# EAGLE design hbridge (EAGLE 7.5.0)
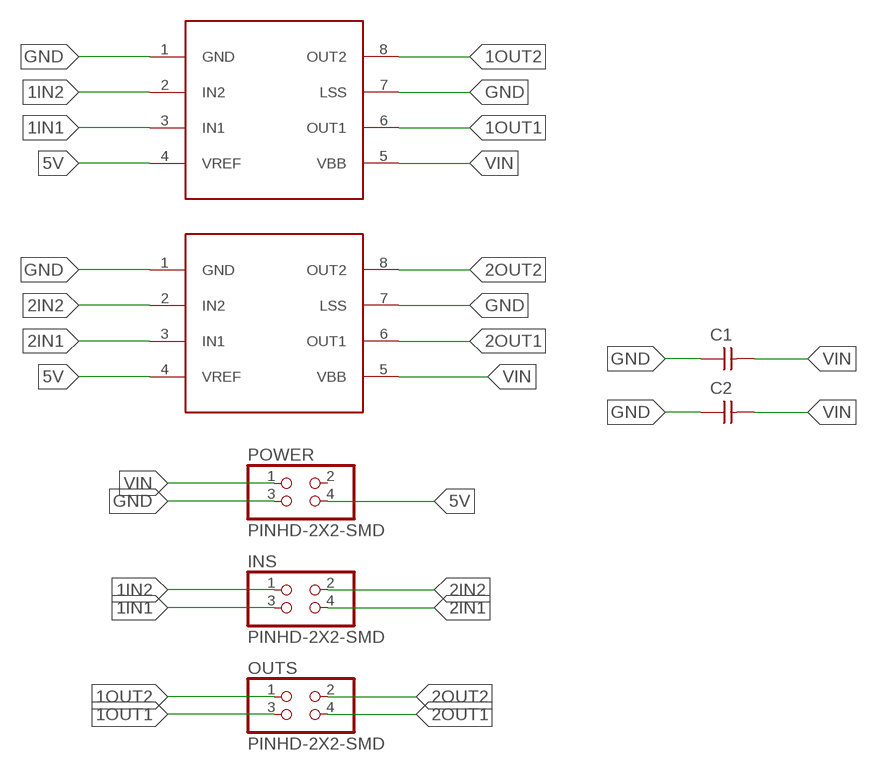
[diagram p0: schematic, sheet 1]

## Parts
C1  CAP-UNPOLARIZEDFAB  [C1206FAB]
C2  CAP-UNPOLARIZEDFAB  [C1206FAB]
INS  PINHD-2X2-SMD  [2X02SMD]
OUTS  PINHD-2X2-SMD  [2X02SMD]
POWER  PINHD-2X2-SMD  [2X02SMD]
U$1  A4953-H-BRIDGE-MOTOR-DRIVER  [SOIC8]
U$2  A4953-H-BRIDGE-MOTOR-DRIVER  [SOIC8]

## Nets
1IN1: INS.3 U$1.3(IN1)
1IN2: INS.1 U$1.2(IN2)
1OUT1: OUTS.3 U$1.6(OUT1)
1OUT2: OUTS.1 U$1.8(OUT2)
2IN1: INS.4 U$2.3(IN1)
2IN2: INS.2 U$2.2(IN2)
2OUT1: OUTS.4 U$2.6(OUT1)
2OUT2: OUTS.2 U$2.8(OUT2)
5V: POWER.4 U$1.4(VREF) U$2.4(VREF)
GND: C1.1 C2.1 POWER.3 U$1.1(GND) U$1.7(LSS) U$2.1(GND) U$2.7(LSS)
VIN: C1.2 C2.2 POWER.1 U$1.5(VBB) U$2.5(VBB)
Unconnected: POWER.2

## Library data of the parts
C1 C2 = fab:CAP-UNPOLARIZED
INS OUTS POWER = fab:PINHD-2X2-SMD
U$1 U$2 = fab:A4953-H-BRIDGE-MOTOR-DRIVER

## Board
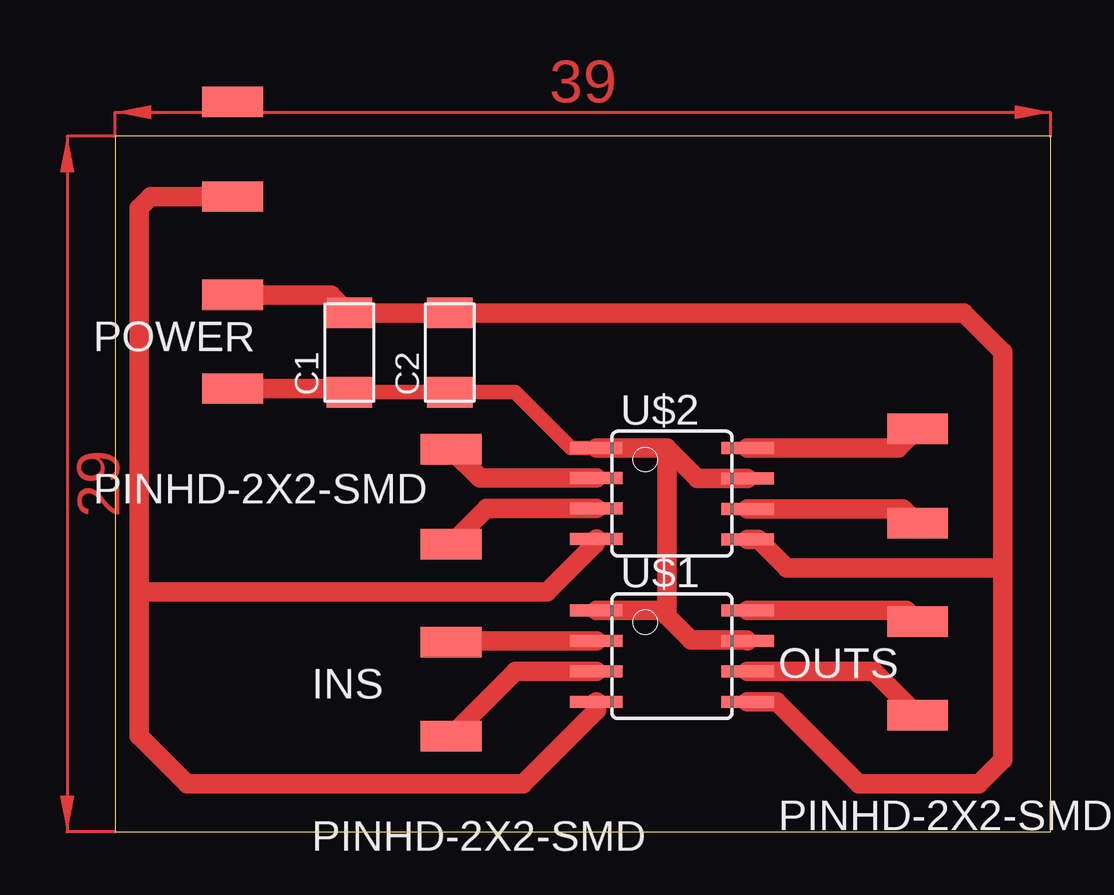
[diagram p1: board, top side]

Size 39 x 29 mm. Coordinates in mm from the lower left corner, seen from the top.
Outline: 0,0 39,0 39,29 0,29 0,0
Copper layers (1*16): Top 0.035mm / dielectric 1.5mm / Bottom 0.035mm
Design rules "default": minimum track width 10mil, minimum drill 24mil, track to track 8mil, track to pad 8mil, pad to pad 8mil, via to via 8mil, smd to smd 8mil, copper to edge 40mil, drill to drill 8mil, minimum pad ring 10mil, minimum via ring 8mil, stop-mask expansion 4mil, vias tented up to drill 0mil, thermal gap 10mil

### Footprints (pad centres in the part's own frame; a part is rotated, then mirrored left to right if it is on the bottom)
C1206FAB = smd 1.27 x 1.905: 1 -1.651,0; 2 1.651,0
2X02SMD = smd 2.54 x 1.27: 1 2,4.905; 2 2,12.945; 3 2,1; 4 2,9
SOIC8 = smd 0.5 x 2.2: 1 -1.905,-3.154; 2 -0.645,-3.154; 3 0.625,-3.154; 4 1.895,-3.154; 5 1.905,3.154; 6 0.635,3.154; 7 -0.635,3.154; 8 -1.905,3.154

### Placement (x,y rotation side)
C1  9.76,19.98 90 top
C2  13.95,19.98 90 top
INS  12,3 0 top
OUTS  31.45,3.86 0 top
POWER  2.89,17.48 0 top
U$1  23.21,7.32 270 top
U$2  23.21,14.1 270 top

### Tracks (layer width: path | path; a pad name or v marks a point on that pad's centre or on a via)
1IN1
  Top 0.813: U$1.3 16.7,6.7 INS.3
1IN2
  Top 0.813: U$1.2 14.06,7.96 INS.1
1OUT1
  Top 0.813: U$1.6 31.62,6.68 OUTS.3
1OUT2
  Top 0.813: U$1.8 32.99,9.22 OUTS.1
2IN1
  Top 0.813: U$2.3 15.47,13.47 INS.4
2IN2
  Top 0.813: U$2.2 15.2,14.74 INS.2
2OUT1
  Top 0.813: U$2.6 32.84,13.46 OUTS.4
2OUT2
  Top 0.813: U$2.8 32.65,16 OUTS.2
5V
  Top 0.813: 1,10 18,10 20,12 20,12.15 U$2.4 | U$1.4 20.06,5.06 17,2 3,2 1,4 1,10 | POWER.4 1.48,26.48 1,26 1,10
GND
  Top 0.61: C1.1 C2.1 16.67,18.33 19,16 U$2.1
  Top 0.813: U$2.7 24.27,14.73 23,16 | 23,16 U$2.1 | U$1.1 22.77,9.22 23,9 | 23,9 24,8 26.32,8 U$1.7 | 23,16 23,9 | POWER.3 9.61,18.48 C1.1
VIN
  Top 0.61: 9.51,21.39 C1.2
  Top 0.813: 37,11 37,3 36,2 31,2 27.59,5.42 U$1.5 | 37,11 37,20 35.37,21.63 C2.2 C1.2 9.01,22.39 POWER.1 | U$2.5 26.8,12.2 28,11 37,11
(copper drawn outside any net)
  shapes: Top area x2